# EAGLE design Aircondition (EAGLE 7.0.0)
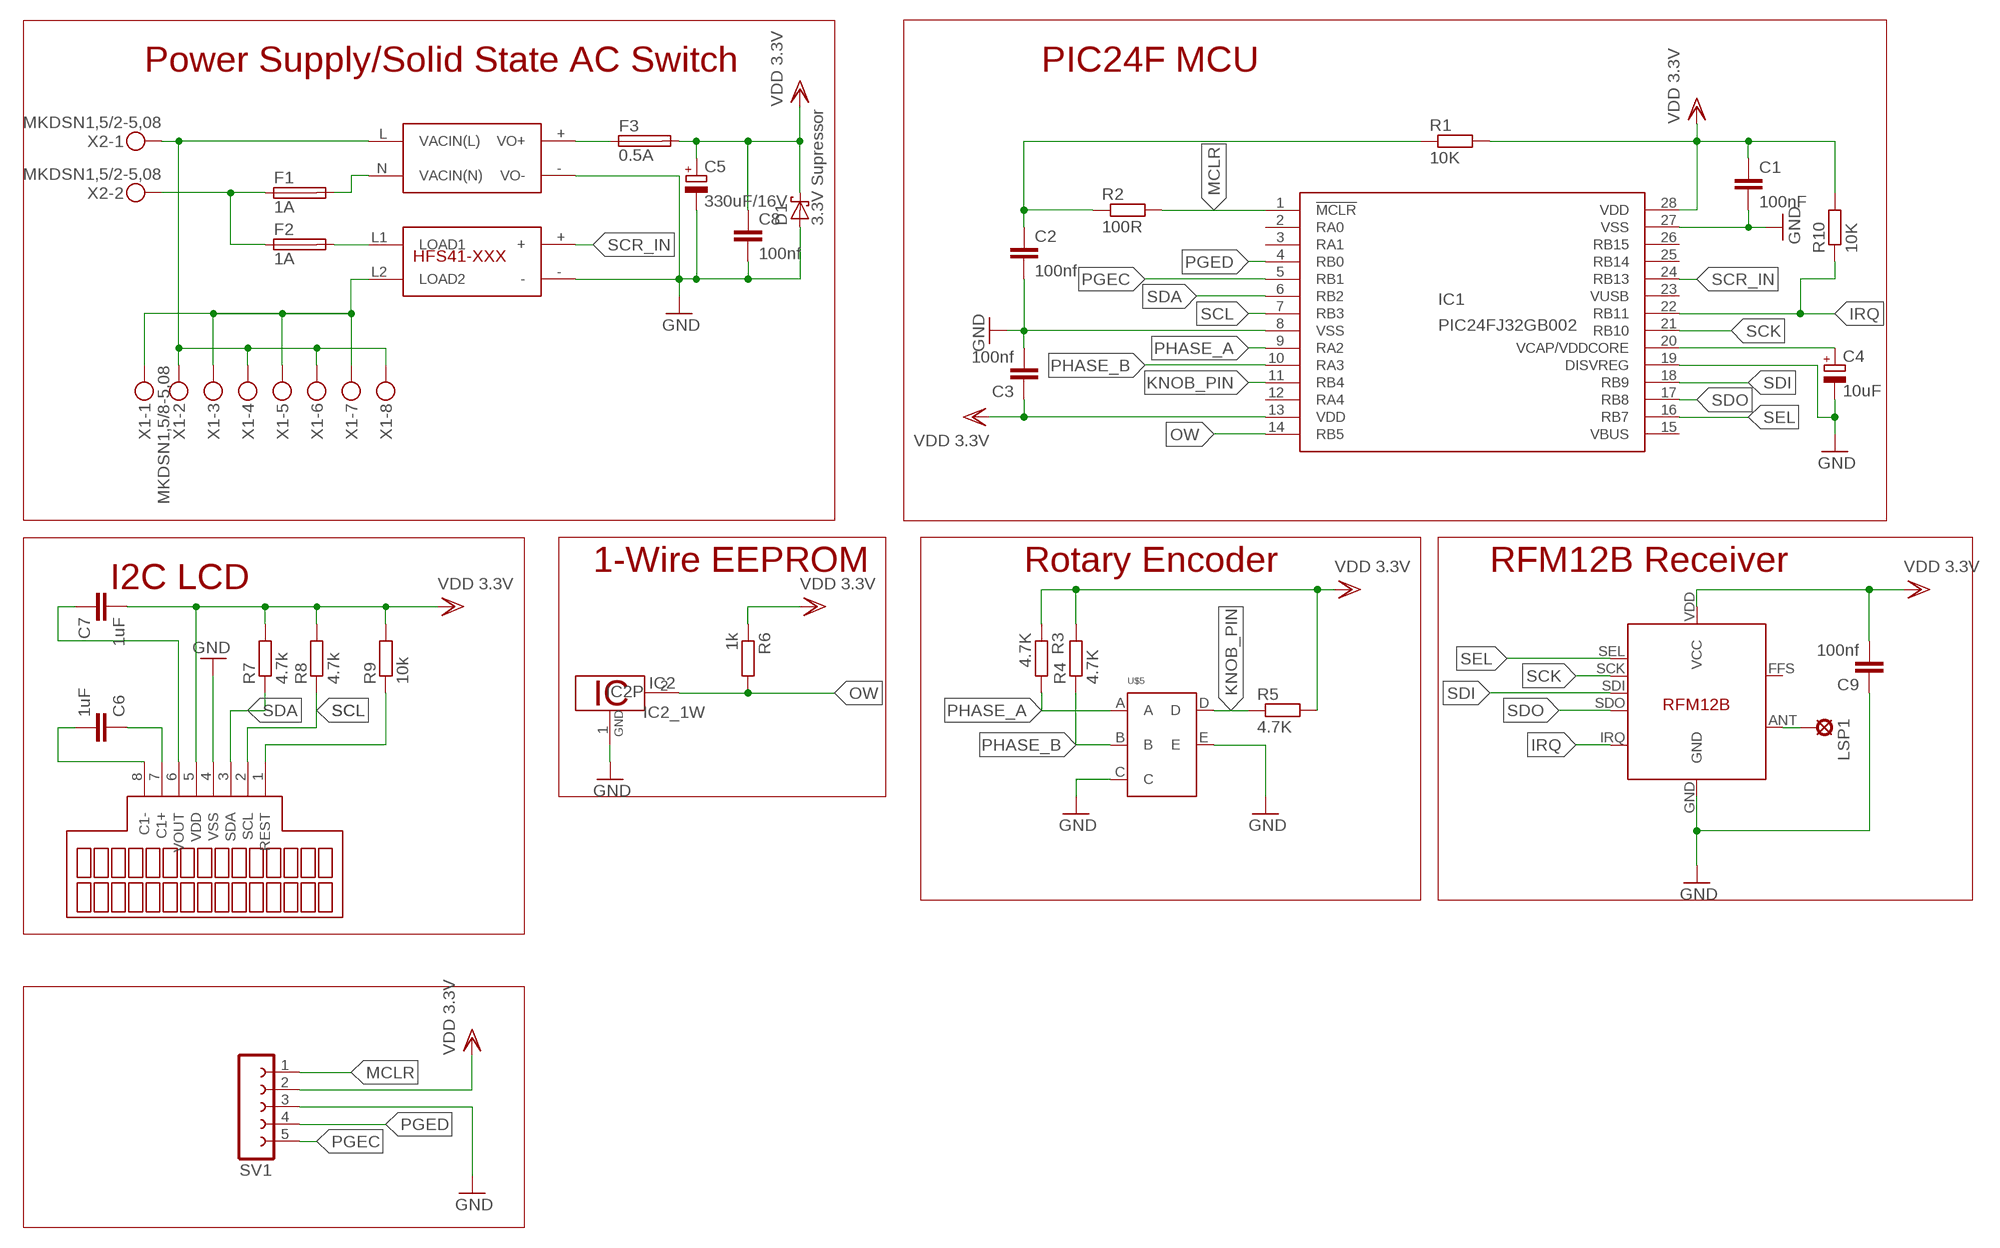
[diagram p0: schematic, sheet 1]

## Parts
C1  100nF  C-EU025-025X050  [C025-025X050]
C2  100nf  C-EU025-025X050  [C025-025X050]
C3  100nf  C-EU102-043X133  [C102-043X133]
C4  10uF  CPOL-EUE5-5  [E5-5]
C5  330uF/16V  CPOL-EUE5-10.5  [E5-10,5]
C6  1uF  C-EU025-025X050  [C025-025X050]
C7  1uF  C-EU025-025X050  [C025-025X050]
C8  100nf  C-EU025-025X050  [C025-025X050]
C9  100nf  C-EU102-043X133  [C102-043X133]
D1  3.3V Supressor  ICTE5  [C4111-15]
F1  1A  FUSESH22,5A  [SH22,5A]
F2  1A  FUSESH22,5A  [SH22,5A]
F3  0.5A  FUSESH22,5A  [SH22,5A]
IC1  PIC24FJ32GB002  [DIL28-3]
IC2  DS2431  [TO92-]
LSP1  ANT  LSP10  [LSP10]
R1  10K  R-EU_0204/5  [0204/5]
R2  100R  R-EU_0204/5  [0204/5]
R3  4.7K  R-EU_0204/7  [0204/7]
R4  4.7K  R-EU_0204/7  [0204/7]
R5  4.7K  R-EU_0204/7  [0204/7]
R6  1k  R-EU_0207/2V  [0207/2V]
R7  4.7k  R-EU_0204/5  [0204/5]
R8  4.7k  R-EU_0204/5  [0204/5]
R9  10k  R-EU_0204/5  [0204/5]
R10  10K  R-EU_0207/10  [0207/10]
SV1  FE05-1  [FE05-1]
U$1  RAC01-3.3SC  RAC01-3.3SCSTANDARD  [RAC01-XXSC]
U$2  HFS41D-240A5Z-NGSTANDARD  [HFS41-EXPOXY-RESIN]
U$3  NHD-C0216CIZ-FN-FBW-3VSIL8-2.54  [SIL8-2.54]
U$4  RFM12B  [RFM12B]
U$5  ENCODER-E  [ENCODER]
X1  MKDSN1,5/8-5,08  [MKDSN1,5/8-5,08]
X2  MKDSN1,5/2-5,08  [MKDSN1,5/2-5,08]

## Nets
GND: C1.2 C2.2 C3.2 C4.- C5.- C8.2 C9.1 D1.A IC1.8(VSS) IC1.19(DISVREG) IC1.27(VSS) IC2.1(GND) SV1.3 U$1.-(VO-) U$2.- U$3.4(VSS) U$4.GND U$5.C U$5.E
IRQ: IC1.22(RB11) R10.1 U$4.IRQ
KNOB_PIN: IC1.11(RB4) R5.1 U$5.D
MCLR: IC1.1(!MCLR) R2.2 SV1.1
N$1: F1.2 U$1.N(VACIN(N))
N$2: F2.2 U$2.L1(LOAD1)
N$4: F1.1 F2.1 X2.2
N$5: U$2.L2(LOAD2) X1.1 X1.3 X1.5 X1.7
N$7: C2.1 R1.1 R2.1
N$8: U$1.L(VACIN(L)) X1.2 X1.4 X1.6 X1.8 X2.1
N$9: F3.1 U$1.+(VO+)
N$13: C4.+ IC1.20(VCAP/VDDCORE)
N$15: LSP1.MP U$4.ANT
N$18: C6.2 U$3.8(C1-)
N$19: C6.1 U$3.7(C1+)
N$20: C7.1 U$3.6(VOUT)
N$22: R9.1 U$3.1(REST)
OW: IC1.14(RB5) IC2.2(1W) R6.2
PGEC: IC1.5(RB1) SV1.5
PGED: IC1.4(RB0) SV1.4
PHASE_A: IC1.9(RA2) R3.2 U$5.A
PHASE_B: IC1.10(RA3) R4.1 U$5.B
SCK: IC1.21(RB10) U$4.SCK
SCL: IC1.7(RB3) R8.1 U$3.2(SCL)
SCR_IN: IC1.24(RB13) U$2.+
SDA: IC1.6(RB2) R7.1 U$3.3(SDA)
SDI: IC1.18(RB9) U$4.SDI
SDO: IC1.17(RB8) U$4.SDO
SEL: IC1.16(RB7) U$4.SEL
VDD: C1.1 C3.1 C5.+ C7.2 C8.1 C9.2 D1.C F3.2 IC1.13(VDD) IC1.28(VDD) R1.2 R3.1 R4.2 R5.2 R6.1 R7.2 R8.2 R9.2 R10.2 SV1.2 U$3.5(VDD) U$4.VDD(VCC) ; supply symbol labelled VDD 3.3V
Unconnected: IC1.2(RA0) IC1.3(RA1) IC1.12(RA4) IC1.15(VBUS) IC1.23(VUSB) IC1.25(RB14) IC1.26(RB15) U$4.FFS

## Notes on the sheet
- Power Supply/Solid State AC Switch | PIC24F MCU
- 1-Wire EEPROM | Rotary Encoder | RFM12B Receiver
- I2C LCD

## Library data of the parts
C1-C3 C6-C9 = resistor:C-EU: CAPACITOR, European symbol
C4 C5 = resistor:CPOL-EU: POLARIZED CAPACITOR, European symbol
D1 = diode:ICTE5: Transient-suppressor DIODE
F1-F3 = fuse:FUSE: Fuse; OC_FARNELL: unknown; OC_NEWARK: unknown
IC1 = PIC24FJXXGB0XX :PIC24FJ32GB002: PIC24FJ32GB002 edit this description DIL 28-3 Package
IC2 = 1wire:DS2431: 1024-Bit EEPROM This chip provides a 4x256 Bit EEPROM, which can be programmed@5V. Write protection and OTP emulation are available, too. Author: Jan Kandziora <jjj@gmx.de>
LSP1 = solpad:LSP10: SOLDER PAD drill 1.0 mm, distributor Buerklin, 12H555
R1-R10 = resistor:R-EU_: RESISTOR, European symbol
SV1 = con-lsta:FE05-1: FEMALE HEADER; OC_FARNELL: unknown; OC_NEWARK: unknown
U$1 = RECOM_RAC01-XX:RAC01-3.3SC
U$2 = hongfa:HFS41D-240A5Z-NG
U$3 = nhd-cog:NHD-C0216CIZ-FN-FBW-3V
U$4 = RFM12B:RFM12B
U$5 = encoder:ENCODER
X1 = con-phoenix-508:MKDSN1,5/8-5,08: MKDSN 1,5/ 8-5,08 Printklemme Nennstrom: 13,5 A Nennspannung: 250 V Rastermaß: 5,08 mm Polzahl: 8 Anschlussart: Schraubanschluss Montage: Löten Anschlussrichtung Leiter/Platine: 0 ° Artikelnummer: 1729186 Source: http://eshop.phoenixcontact.com .. 1729186.pdf
X2 = con-phoenix-508:MKDSN1,5/2-5,08: MKDSN 1,5/ 2-5,08 Printklemme Nennstrom: 13,5 A Nennspannung: 250 V Rastermaß: 5,08 mm Polzahl: 2 Anschlussart: Schraubanschluss Montage: Löten Anschlussrichtung Leiter/Platine: 0 ° Artikelnummer: 1729128 Source: http://eshop.phoenixcontact.com .. 1729128.pdf

## Board
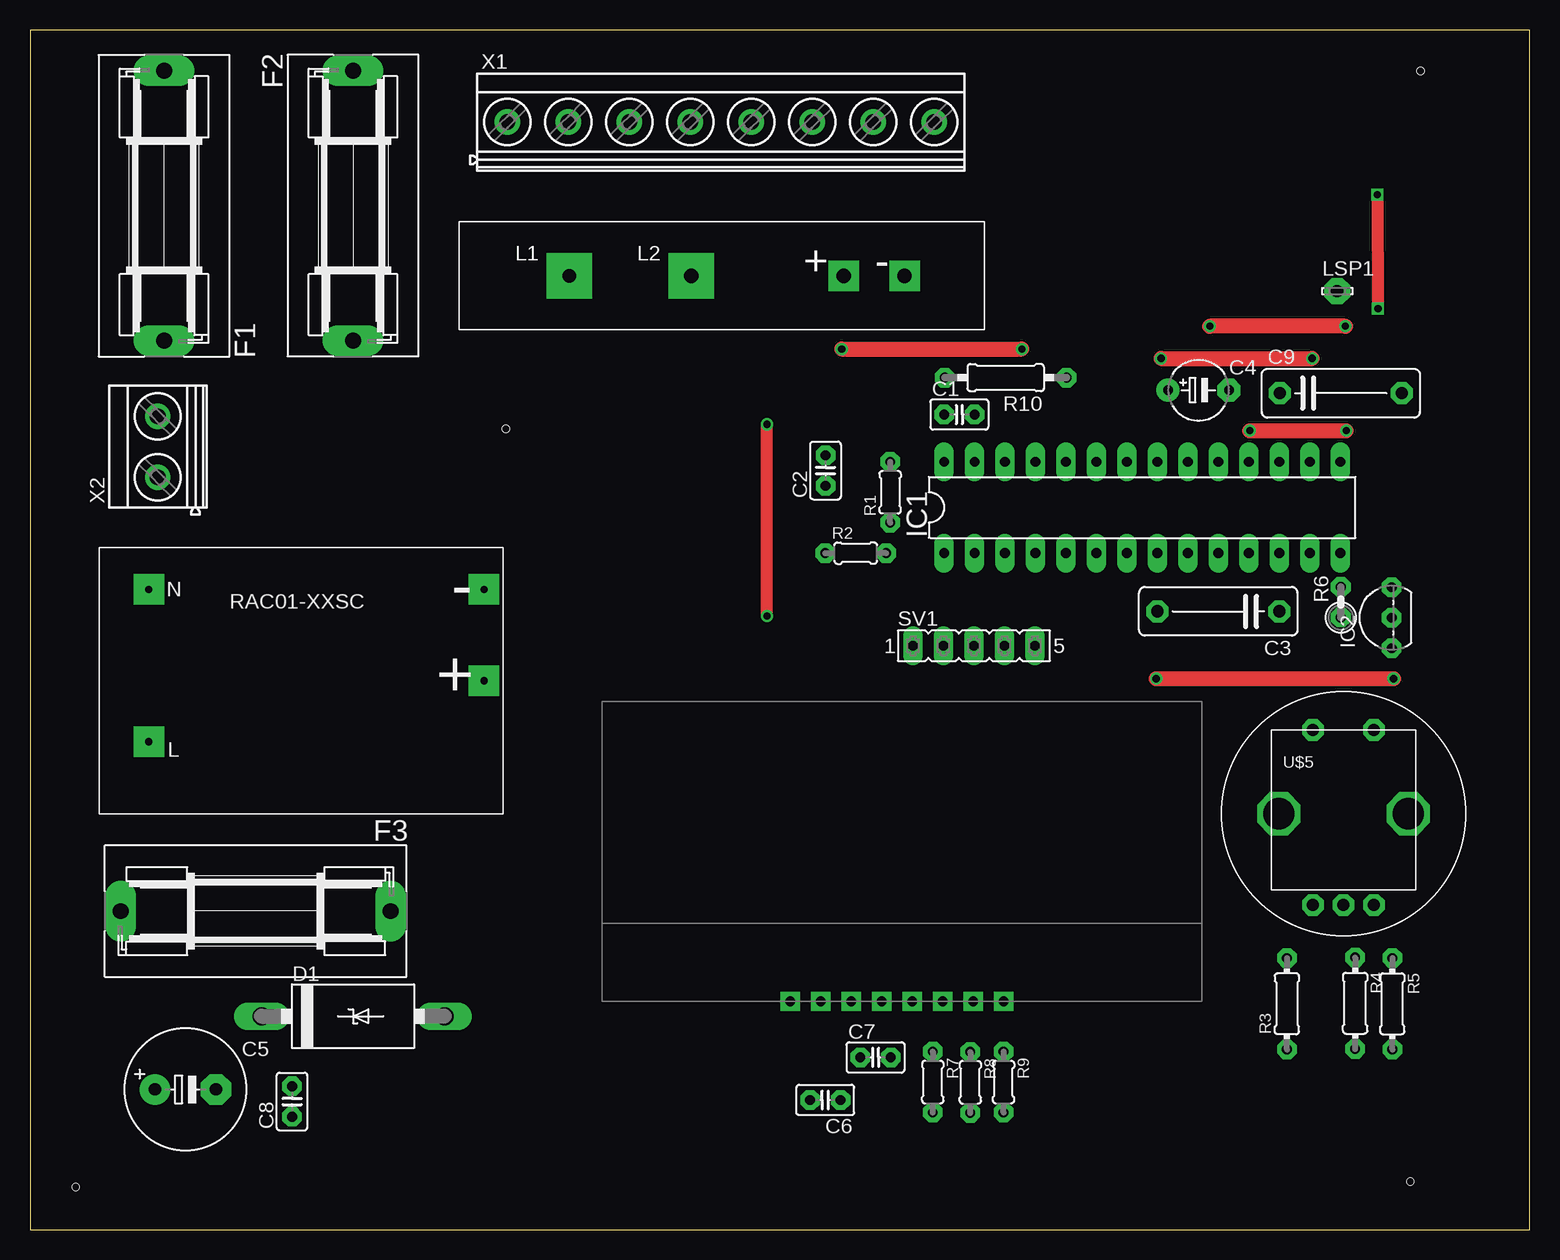
[diagram p1: board, top side]
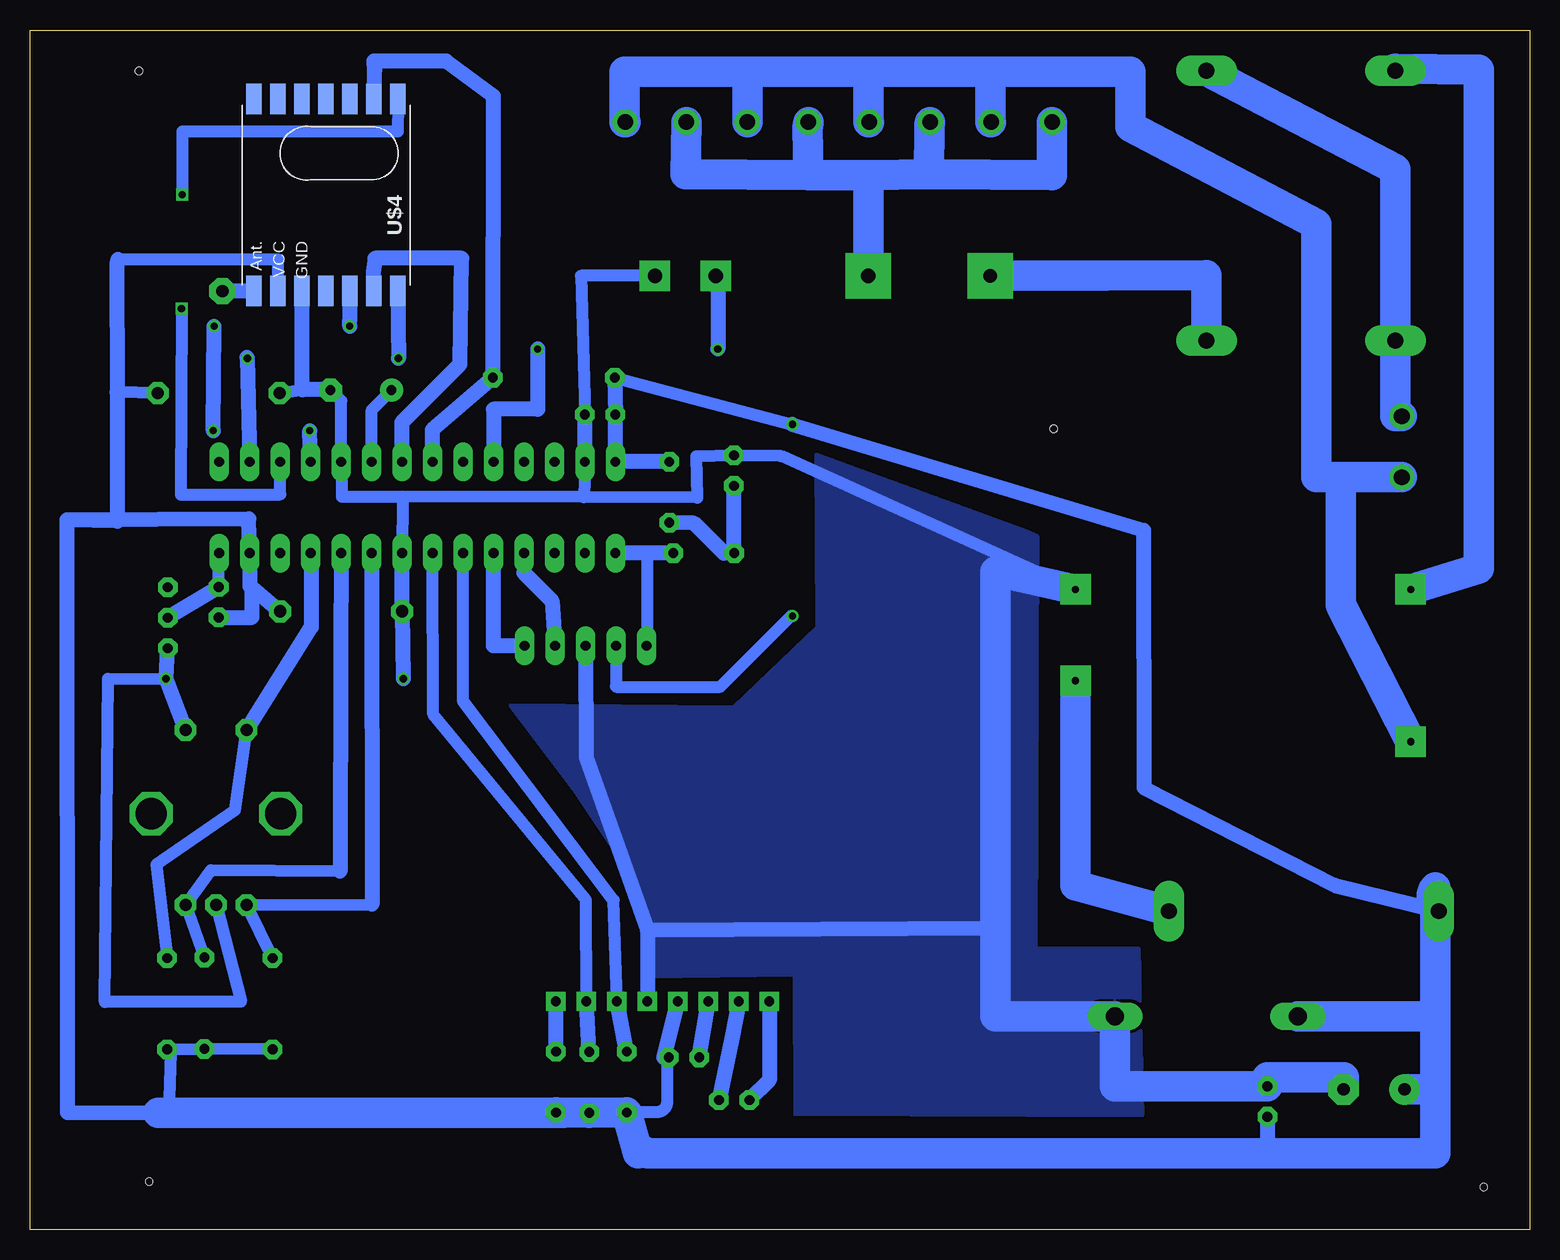
[diagram p2: board, bottom side, seen from below]

Size 125 x 100 mm. Coordinates in mm from the lower left corner, seen from the top.
Outline: 0,0 125,0 125,100 0,100 0,0
Copper layers (1*16): Top 0.035mm / dielectric 1.5mm / Bottom 0.035mm
Design rules "default *": minimum track width 10mil, minimum drill 24mil, track to track 8mil, track to pad 8mil, pad to pad 8mil, via to via 8mil, smd to smd 8mil, copper to edge 40mil, drill to drill 8mil, minimum pad ring 16mil, minimum via ring 8mil, stop-mask expansion 4mil, vias tented up to drill 0mil, thermal gap 10mil
Holes 0.6 mm at 39.67,66.75 3.81,3.56 115.06,3.99 115.93,96.57

### Footprints (pad centres in the part's own frame; a part is rotated, then mirrored left to right if it is on the bottom)
C025-025X050 = drill 0.813 octagon: 1 -1.27,0; 2 1.27,0
C102-043X133 = drill 1.016 octagon: 1 -5.08,0; 2 5.08,0
E5-5 = drill 0.813 pad 1.905: + -2.54,0 | drill 0.813 pad 1.905 octagon: - 2.54,0
E5-10,5 = drill 1.016 pad 2.54: + -2.54,0 | drill 1.016 pad 2.54 octagon: - 2.54,0
C4111-15 = drill 1.499 long: A 7.62,0; C -7.62,0
SH22,5A = drill 1.321 pad 2.54 long: 1 -11.252,0; 2 11.252,0
DIL28-3 = drill 0.813 long: 1 -16.51,-3.81; 2 -13.97,-3.81; 3 -11.43,-3.81; 4 -8.89,-3.81; 5 -6.35,-3.81; 6 -3.81,-3.81; 7 -1.27,-3.81; 8 1.27,-3.81; 9 3.81,-3.81; 10 6.35,-3.81; 11 8.89,-3.81; 12 11.43,-3.81; 13 13.97,-3.81; 14 16.51,-3.81; 15 16.51,3.81; 16 13.97,3.81; 17 11.43,3.81; 18 8.89,3.81; 19 6.35,3.81; 20 3.81,3.81; 21 1.27,3.81; 22 -1.27,3.81; 23 -3.81,3.81; 24 -6.35,3.81; 25 -8.89,3.81; 26 -11.43,3.81; 27 -13.97,3.81; 28 -16.51,3.81
TO92- = drill 0.813 octagon: 1 -2.54,0; 2 0,0; 3 2.54,0
LSP10 = drill 1.016 pad 2.159 octagon: MP 0,0
0204/5 = drill 0.813 octagon: 1 -2.54,0; 2 2.54,0
0204/7 = drill 0.813 octagon: 1 -3.81,0; 2 3.81,0
0207/2V = drill 0.813 octagon: 1 -1.27,0; 2 1.27,0
0207/10 = drill 0.813 octagon: 1 -5.08,0; 2 5.08,0
FE05-1 = drill 0.813 long: 1 -5.08,0; 2 -2.54,0; 3 0,0; 4 2.54,0; 5 5.08,0
RAC01-XXSC = drill 0.6 pad 2.54 square: + 15.24,0; - 15.24,7.62; L -12.7,-5.08; N -12.7,7.62
HFS41-EXPOXY-RESIN = drill 1.2 pad 2.54 square: + -10.16,0; - -15.24,0 | drill 1.1 pad 3.81 square: L1 12.7,0 | drill 1.2 pad 3.81 square: L2 2.54,0
SIL8-2.54 = drill 0.8 square: 1 7.62,-5.08; 2 5.08,-5.08; 3 2.54,-5.08; 4 0,-5.08; 5 -2.54,-5.08; 6 -5.08,-5.08; 7 -7.62,-5.08; 8 -10.16,-5.08
RFM12B = smd 2.54 x 1.27: ANT 8,-6; FFS -8,2; GND 8,-2; IRQ -8,4; P$8 -8,0; P$9 -8,-2; P$10 -8,-4; P$12 -8,-6; P$16 8,0; SCK 8,4; SDI 8,2; SDO -8,6; SEL 8,6; VDD 8,-4
ENCODER = drill 1 octagon: A -2.54,-7.62; B 2.54,-7.62; C 0,-7.62; D -2.54,6.985; E 2.54,6.985 | drill 2.6 octagon: P$1 5.397,0; P$2 -5.397,0
MKDSN1,5/8-5,08 = drill 1.3 pad 2: 1 -17.801,0.025; 2 -12.721,0.025; 3 -7.641,0.025; 4 -2.561,0.025; 5 2.519,0.025; 6 7.599,0.025; 7 12.679,0.025; 8 17.759,0.025
MKDSN1,5/2-5,08 = drill 1.3 pad 2: 1 -2.561,0.025; 2 2.519,0.025

### Placement (x,y rotation side)
C1  77.47,67.94 0 top
C2  66.32,63.27 90 top
C3  99.06,51.54 180 top
C4  97.41,69.98 0 top
C5  12.95,11.68 0 top
C6  66.29,10.79 180 top
C7  70.48,14.35 0 top
C8  21.84,10.67 90 top
C9  109.27,69.72 0 top
D1  26.92,17.78 0 top
F1  11.18,85.34 90 top
F2  26.92,85.34 270 top
F3  18.82,26.54 180 top
IC1  92.71,60.2 0 top
IC2  113.51,51 90 top
LSP1  108.97,78.23 0 top
R1  71.7,61.47 90 top
R2  68.83,56.39 0 top
R3  104.78,18.82 90 top
R4  110.46,18.87 270 top
R5  113.56,18.82 270 top
R6  109.27,52.3 90 top
R7  75.26,12.29 270 top
R8  78.38,12.27 270 top
R9  81.15,12.29 270 top
R10  81.33,71.02 180 top
SV1  78.69,48.67 0 top
U$1  22.61,45.75 0 top
U$2  57.66,79.5 180 top
U$3  73.53,24.1 0 top
U$4  100.33,86.23 270 bottom
U$5  109.5,34.67 0 top
X1  57.6,92.3 0 top
X2  10.67,65.28 90 top

### Tracks (layer width: path | path; a pad name or v marks a point on that pad's centre or on a via)
GND  (via drill 0.6)
  Top 1.27: v93.88,45.92 v113.67,45.92
  Bottom 1.016: C4.- 99.06,69.09 IC1.19 99.01,61.09 93.95,61.09 | 93.95,61.09 IC1.8 | IC1.27 78.82,61.06 | 78.82,61.06 93.95,61.09 | U$1.- 62.36,64.47 C2.2 69.47,64.44 69.39,61.01 78.82,61.06 | U$2.- 79.07,79.5 C1.2 | U$5.C 107.42,19 118.77,18.97 118.49,45.9 v113.67,45.92 | C9.1 102.31,70
  Bottom 1.27: IC1.27 C1.2 | IC1.8 C3.2 v93.88,45.92 | C4.- 99.97,70 102.31,70 102.33,70.02 U$4.GND | IC2.1 v113.67,45.92 U$5.E | 78.69,48.64 SV1.3 78.64,39.37 73.53,24.94 | 44.5,17.78 44.65,25.12 73.53,24.94 | 73.53,24.94 U$3.4
  Bottom 2.54: C5.- 15.49,12.7 21.84,12.7 C8.2 34.54,11.94 D1.A 44.5,17.78 44.5,54.86 U$1.-
  pour Bottom: 41.94,58.22 59.51,64.64 59.44,50.24 66.39,43.56 85.01,43.71 79.71,36.68 73.71,27.79 73.74,21.06 61.32,21.23 61.26,9.6 32.23,9.5 32.54,23.42 41.12,23.42 40.97,57.81
IRQ
  Bottom 1.27: IC1.22 91.44,66.67 R10.1 86.36,94.49 90.3,97.41 96.33,97.41 | 96.27,96.65 96.33,97.41 | 96.33,97.41 U$4.IRQ
KNOB_PIN
  Bottom 1.016: U$5.D 107.9,34.98 114.48,30.43 R5.1
  Bottom 1.27: IC1.11 101.58,56.39 101.55,50.22 U$5.D
MCLR
  Bottom 1.016: SV1.1 73.53,48.67 73.53,56.39
  Bottom 1.27: R2.2 73.53,56.39 IC1.1
N$1
  Bottom 2.54: U$1.N 4.22,55.12 4.24,96.67 11.18,96.77 F1.2
N$2
  Bottom 2.54: F2.2 26.92,79.58 35.31,79.5 U$2.L1
N$4
  Bottom 2.54: X2.2 11.18,67.8 F1.1 11.18,88.39 F2.1
N$5
  Bottom 2.54: 50.06,87.99 39.8,87.88 X1.1 | X1.7 70.33,87.99 60.12,87.88 | X1.5 60.2,91.82 60.12,87.88 | 60.12,87.88 55.12,87.88 | 55.12,87.88 50.06,87.99 | 50.06,87.99 50.04,92.08 X1.3 | U$2.L2 55.12,87.88
N$7
  Bottom 1.27: R1.1 69.65,58.88 67.16,56.39 R2.1 66.29,61.98 C2.1
N$8
  Bottom 2.54: X1.8 75.44,92.33 75.44,96.52 65.2,96.52 | 65.2,96.52 X1.6 | X1.4 55.12,92.33 55.12,96.52 | 55.12,96.52 65.2,96.52 | X1.2 44.96,92.33 44.96,96.52 | 44.96,96.52 55.12,96.52 | X2.1 15.75,62.73 | 15.75,62.73 17.78,62.74 17.78,83.82 33.27,91.95 33.27,96.52 44.96,96.52 | U$1.L 15.75,52.07 15.75,62.73
N$9
  Bottom 2.54: F3.1 37.85,28.7 U$1.+
N$13
  Bottom 1.016: IC1.20 96.52,68.33 C4.+
N$15
  Bottom 1.27: U$4.ANT LSP1.MP
N$18
  Bottom 1.27: U$3.8 63.37,12.45 C6.2
N$19
  Bottom 1.27: U$3.7 66.47,16.03 C6.1
N$20
  Bottom 1.27: C7.1 U$3.6
N$22
  Bottom 1.27: R9.1 U$3.1
OW
  Bottom 1.016: R6.2 IC1.14
  Bottom 1.27: IC2.2 R6.2
PGEC
  Bottom 1.27: SV1.5 86.36,48.67 IC1.5
PGED
  Bottom 1.016: SV1.4 81.28,48.67
  Bottom 1.27: IC1.4 83.82,54.74 81.48,52.4 SV1.4
PHASE_A
  Bottom 1.016: R3.2 U$5.A 96.5,27.12
  Bottom 1.27: IC1.9 96.5,27.12
PHASE_B
  Bottom 1.016: 99.16,29.87 109.93,29.95 U$5.B R4.1
  Bottom 1.27: IC1.10 99.08,48.08 99.16,29.87
SCK
  Bottom 1.27: IC1.21 93.98,67.31 89.15,72.14 89,80.97 96.24,80.97 96.39,79.82 U$4.SCK
SCL
  Bottom 1.016: U$3.2 78.65,27.47 91.39,42.95 IC1.7
  Bottom 1.27: R8.1 U$3.2
SCR_IN  (via drill 0.6)
  Top 1.27: v67.67,73.41 v82.68,73.41
  Bottom 1.27: U$2.+ 67.67,79.5 v67.67,73.41 | v82.68,73.41 82.68,68.38 86.36,68.38 IC1.24
SDA
  Bottom 1.016: U$3.3 76.33,27.44 88.9,44.07 IC1.6
  Bottom 1.27: R7.1 U$3.3
SDI  (via drill 0.6)
  Top 1.27: v101.68,66.6 v109.73,66.6 | v109.65,75.31 v98.35,75.31
  Bottom 1.27: IC1.18 v101.68,66.6 | v109.73,66.6 v109.65,75.31 | v98.35,75.31 98.35,75.84 98.33,75.84 U$4.SDI
SDO  (via drill 0.6)
  Top 1.016: v112.32,86.26 v112.37,76.76
  Bottom 1.016: U$4.SDO 94.33,93.76 94.34,91.54 112.29,91.54 v112.32,86.26 | v112.37,76.76 112.42,61.27 104.14,61.29 IC1.17
SEL  (via drill 0.6)
  Top 1.27: v94.28,72.62 v106.88,72.62
  Bottom 1.27: U$4.SEL 94.31,78.21 94.31,75.23 v94.28,72.62 | v106.88,72.62 106.91,72.69 IC1.16
VDD  (via drill 0.6)
  Top 1.016: v61.45,51.16 v61.45,67.12
  Bottom 1.016: C7.2 arc-90 71.88,14.22 71.88,10.67 arc90 72.77,9.78 R7.2 | U$4.VDD 104.32,80.87 117.65,80.87 | IC1.28 76.3,64.03 76.12,64.08 | R3.1 R4.2 R5.2 113.28,14.71 113.44,9.73 | R10.2 v61.45,67.12 | C9.2 117.74,69.8 | SV1.2 76.15,45.29 76.12,45.24 67.46,45.24 61.54,51.16 v61.45,51.16
  Bottom 1.27: C8.1 21.84,6.35 | 117.65,80.87 117.75,80.54 117.74,69.8 117.73,59.05 121.92,59.16 | R1.2 IC1.28 C1.1 R10.2 | 114.28,9.7 114.3,9.7 114.3,9.73 121.89,9.75 121.92,59.16 | 121.92,59.16 106.76,59.23 IC1.13 106.66,53.65 106.5,53.51 | C3.1 106.5,53.51 | v61.45,67.12 32.18,58.29 32.13,36.83 16.23,28.7 F3.2 | R6.1 106.5,51.03 106.5,53.51 | C7.2 72.16,14.35 U$3.5
  Bottom 2.54: F3.2 arc90 7.87,28.52 7.87,17.91 | 7.87,17.91 arc90 8,17.78 D1.C | C5.+ 7.87,11.68 | 7.87,11.68 7.87,17.91 | 7.87,11.68 7.87,6.35 21.84,6.35 73.53,6.35 arc-90 74.3,6.35 R7.2 R8.2 R9.2 80.52,9.73 113.44,9.73 114.3,9.73